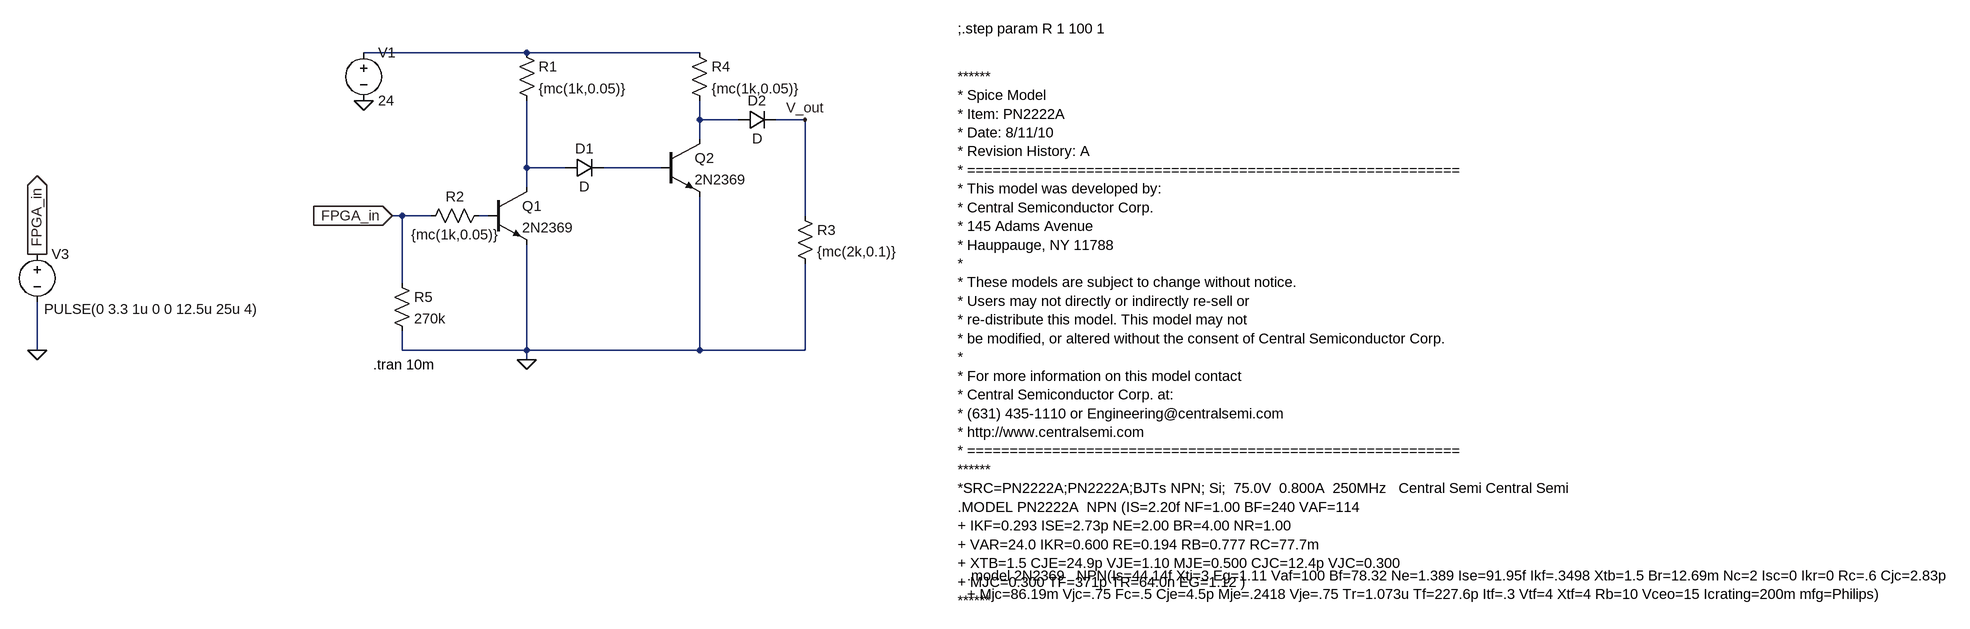
[diagram p0: schematic Transmitter.asc]
Transmitter.asc, the LTspice schematic file:
Version 4
SHEET 1 2848 804
WIRE 160 -112 -112 -112
WIRE 448 -112 160 -112
WIRE 448 0 448 -32
WIRE 512 0 448 0
WIRE 624 0 576 0
WIRE 448 32 448 0
WIRE 160 80 160 -32
WIRE 224 80 160 80
WIRE 384 80 288 80
WIRE 160 112 160 80
WIRE -48 160 -64 160
WIRE 0 160 -48 160
WIRE 96 160 80 160
WIRE 624 160 624 0
WIRE -48 272 -48 160
WIRE -656 384 -656 304
WIRE -48 384 -48 352
WIRE 160 384 160 208
WIRE 160 384 -48 384
WIRE 448 384 448 128
WIRE 448 384 160 384
WIRE 624 384 624 240
WIRE 624 384 448 384
WIRE 160 400 160 384
FLAG -112 -32 0
FLAG 160 400 0
FLAG -64 160 FPGA_in
IOPIN -64 160 In
FLAG -656 224 FPGA_in
IOPIN -656 224 Out
FLAG -656 384 0
FLAG 624 0 V_out
SYMBOL voltage -112 -128 R0
WINDOW 123 0 0 Left 0
WINDOW 39 0 0 Left 0
SYMATTR InstName V1
SYMATTR Value 24
SYMBOL res 96 144 R90
WINDOW 0 0 56 VBottom 2
WINDOW 3 32 56 VTop 2
SYMATTR InstName R2
SYMATTR Value {mc(1k,0.05)}
SYMBOL npn 96 112 R0
SYMATTR InstName Q1
SYMATTR Value 2N2369
SYMBOL res 144 -128 R0
SYMATTR InstName R1
SYMATTR Value {mc(1k,0.05)}
SYMBOL res 608 144 R0
SYMATTR InstName R3
SYMATTR Value {mc(2k,0.1)}
SYMBOL npn 384 32 R0
SYMATTR InstName Q2
SYMATTR Value 2N2369
SYMBOL res 432 -128 R0
SYMATTR InstName R4
SYMATTR Value {mc(1k,0.05)}
SYMBOL voltage -656 208 R0
WINDOW 3 12 108 Left 2
WINDOW 123 0 0 Left 0
WINDOW 39 0 0 Left 0
SYMATTR Value PULSE(0 3.3 1u 0 0 12.5u 25u 4)
SYMATTR InstName V3
SYMBOL res -64 256 R0
SYMATTR InstName R5
SYMATTR Value 270k
SYMBOL diode 224 96 R270
WINDOW 0 32 32 VTop 2
WINDOW 3 0 32 VBottom 2
SYMATTR InstName D1
SYMBOL diode 512 16 R270
WINDOW 0 32 32 VTop 2
WINDOW 3 0 32 VBottom 2
SYMATTR InstName D2
TEXT -96 408 Left 2 !.tran 10m
TEXT 1008 -72 Left 2 !******\n* Spice Model\n* Item: PN2222A\n* Date: 8/11/10\n* Revision History: A\n* ==========================================================\n* This model was developed by: \n* Central Semiconductor Corp.\n* 145 Adams Avenue\n* Hauppauge, NY 11788\n*\n* These models are subject to change without notice.\n* Users may not directly or indirectly re-sell or \n* re-distribute this model. This model may not \n* be modified, or altered without the consent of Central Semiconductor Corp. \n*\n* For more information on this model contact\n* Central Semiconductor Corp. at:\n* (631) 435-1110 or Engineering@centralsemi.com\n* http://www.centralsemi.com\n* ==========================================================\n******\n*SRC=PN2222A;PN2222A;BJTs NPN; Si;  75.0V  0.800A  250MHz   Central Semi Central Semi\n.MODEL PN2222A  NPN (IS=2.20f NF=1.00 BF=240 VAF=114\n+ IKF=0.293 ISE=2.73p NE=2.00 BR=4.00 NR=1.00\n+ VAR=24.0 IKR=0.600 RE=0.194 RB=0.777 RC=77.7m\n+ XTB=1.5 CJE=24.9p VJE=1.10 MJE=0.500 CJC=12.4p VJC=0.300\n+ MJC=0.300 TF=371p TR=64.0n EG=1.12 )\n******
TEXT 1024 760 Left 2 !.model 2N2369   NPN(Is=44.14f Xti=3 Eg=1.11 Vaf=100 Bf=78.32 Ne=1.389 Ise=91.95f Ikf=.3498 Xtb=1.5 Br=12.69m Nc=2 Isc=0 Ikr=0 Rc=.6 Cjc=2.83p\n+ Mjc=86.19m Vjc=.75 Fc=.5 Cje=4.5p Mje=.2418 Vje=.75 Tr=1.073u Tf=227.6p Itf=.3 Vtf=4 Xtf=4 Rb=10 Vceo=15 Icrating=200m mfg=Philips)
TEXT 1008 -152 Left 2 !;.step param R 1 100 1

The netlist it stands for:
* Transmitter.asc
V1 N001 0 24
R2 N005 FPGA_in {mc(1k,0.05)}
Q1 N003 N005 0 0 2N2369
R1 N001 N003 {mc(1k,0.05)}
R3 V_out 0 {mc(2k,0.1)}
Q2 N002 N004 0 0 2N2369
R4 N001 N002 {mc(1k,0.05)}
V3 FPGA_in 0 PULSE(0 3.3 1u 0 0 12.5u 25u 4)
R5 FPGA_in 0 270k
D1 N003 N004 D
D2 N002 V_out D
.model D D
.lib standard.dio
.model NPN NPN
.model PNP PNP
.lib standard.bjt
.tran 10m
******
* Spice Model
* Item: PN2222A
* Date: 8/11/10
* Revision History: A
* ==========================================================
* This model was developed by:
* Central Semiconductor Corp.
* 145 Adams Avenue
* Hauppauge, NY 11788
*
* These models are subject to change without notice.
* Users may not directly or indirectly re-sell or
* re-distribute this model. This model may not
* be modified, or altered without the consent of Central Semiconductor Corp.
*
* For more information on this model contact
* Central Semiconductor Corp. at:
* (631) 435-1110 or Engineering@centralsemi.com
* http://www.centralsemi.com
* ==========================================================
******
*SRC=PN2222A;PN2222A;BJTs NPN; Si;  75.0V  0.800A  250MHz   Central Semi Central Semi
.MODEL PN2222A  NPN (IS=2.20f NF=1.00 BF=240 VAF=114
+ IKF=0.293 ISE=2.73p NE=2.00 BR=4.00 NR=1.00
+ VAR=24.0 IKR=0.600 RE=0.194 RB=0.777 RC=77.7m
+ XTB=1.5 CJE=24.9p VJE=1.10 MJE=0.500 CJC=12.4p VJC=0.300
+ MJC=0.300 TF=371p TR=64.0n EG=1.12 )
******
.model 2N2369   NPN(Is=44.14f Xti=3 Eg=1.11 Vaf=100 Bf=78.32 Ne=1.389 Ise=91.95f Ikf=.3498 Xtb=1.5 Br=12.69m Nc=2 Isc=0 Ikr=0 Rc=.6 Cjc=2.83p
+ Mjc=86.19m Vjc=.75 Fc=.5 Cje=4.5p Mje=.2418 Vje=.75 Tr=1.073u Tf=227.6p Itf=.3 Vtf=4 Xtf=4 Rb=10 Vceo=15 Icrating=200m mfg=Philips)
;.step param R 1 100 1
.backanno
.end